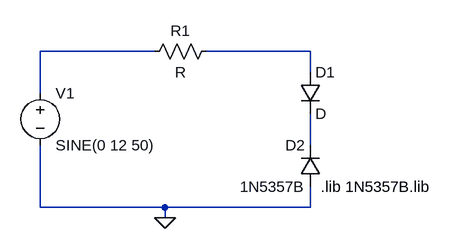
[diagram p0: schematic Draft1.asc]
Draft1.asc, the LTspice schematic file:
Version 4.1
SHEET 1 880 680
WIRE 192 64 16 64
WIRE 432 64 272 64
WIRE 432 96 432 64
WIRE 16 128 16 64
WIRE 432 208 432 160
WIRE 16 304 16 208
WIRE 208 304 16 304
WIRE 432 304 432 272
WIRE 432 304 208 304
WIRE 208 320 208 304
FLAG 208 320 0
SYMBOL voltage 16 112 R0
WINDOW 123 0 0 Left 0
WINDOW 39 0 0 Left 0
SYMATTR InstName V1
SYMATTR Value SINE(0 12 50)
SYMBOL res 288 48 R90
WINDOW 0 0 56 VBottom 2
WINDOW 3 32 56 VTop 2
SYMATTR InstName R1
SYMBOL diode 416 96 R0
SYMATTR InstName D1
SYMBOL diode 448 272 R180
WINDOW 0 24 64 Left 2
WINDOW 3 24 0 Left 2
SYMATTR InstName D2
SYMATTR Value 1N5357B
SYMATTR Prefix X
SYMATTR Description Diode
SYMATTR Type diode
TEXT 448 272 Left 2 !.lib 1N5357B.lib

The netlist it stands for:
* Draft1.asc
V1 N001 0 SINE(0 12 50)
R1 N002 N001 R
D1 N002 N003 D
X§D2 0 N003 1N5357B  ; pins + -
.model D D
.lib standard.dio
.lib 1N5357B.lib
.backanno
.end